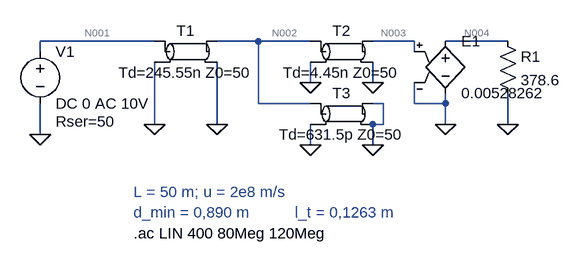
[diagram p0: schematic Q1.asc]
Q1.asc, the LTspice schematic file:
Version 4
SHEET 1 880 700
WIRE 96 128 -80 128
WIRE 256 128 192 128
WIRE 336 128 256 128
WIRE 496 128 432 128
WIRE 640 128 544 128
WIRE -80 144 -80 128
WIRE 496 144 496 128
WIRE 336 192 336 160
WIRE 432 192 432 160
WIRE 256 224 256 128
WIRE 336 224 256 224
WIRE 448 224 432 224
WIRE 496 224 496 192
WIRE 544 224 544 208
WIRE 544 224 496 224
WIRE 96 256 96 160
WIRE 192 256 192 160
WIRE 448 256 448 224
WIRE 448 256 432 256
WIRE 544 256 544 224
WIRE 640 256 640 208
WIRE -80 272 -80 224
WIRE 336 288 336 256
WIRE 432 288 432 256
FLAG -80 272 0
FLAG 96 256 0
FLAG 192 256 0
FLAG 640 256 0
FLAG 336 288 0
FLAG 432 288 0
FLAG 432 192 0
FLAG 336 192 0
FLAG 544 256 0
SYMBOL tline 144 144 R0
SYMATTR InstName T1
SYMATTR Value Td=245.55n Z0=50
SYMBOL res 624 112 R0
SYMATTR InstName R1
SYMATTR Value 378.6
SYMBOL voltage -80 128 R0
WINDOW 123 0 0 Left 0
WINDOW 39 24 124 Left 2
SYMATTR SpiceLine Rser=50
SYMATTR InstName V1
SYMATTR Value DC 0 AC 10V
SYMBOL tline 384 144 R0
SYMATTR InstName T2
SYMATTR Value Td=4.45n Z0=50
SYMBOL tline 384 240 R0
SYMATTR InstName T3
SYMATTR Value Td=631.5p Z0=50
SYMBOL e 544 112 R0
SYMATTR InstName E1
SYMATTR Value 0.00528262
TEXT 64 424 Left 2 !.ac LIN 400 80Meg 120Meg
TEXT 64 392 Left 2 ;d_min = 0,890 m
TEXT 312 392 Left 2 ;l_t = 0,1263 m
TEXT 64 360 Left 2 ;L = 50 m; u = 2e8 m/s

The netlist it stands for:
* Q1.asc
T1 N001 0 N002 0 Td=245.55n Z0=50
R1 N004 0 378.6
V1 N001 0 DC 0 AC 10V Rser=50
T2 N002 0 N003 0 Td=4.45n Z0=50
T3 N002 0 0 0 Td=631.5p Z0=50
E1 N004 0 N003 0 0.00528262
.ac LIN 400 80Meg 120Meg
* d_min = 0,890 m
* l_t = 0,1263 m
* L = 50 m; u = 2e8 m/s
.backanno
.end

* Results of the author's LTspice run, read from the files saved beside the schematic
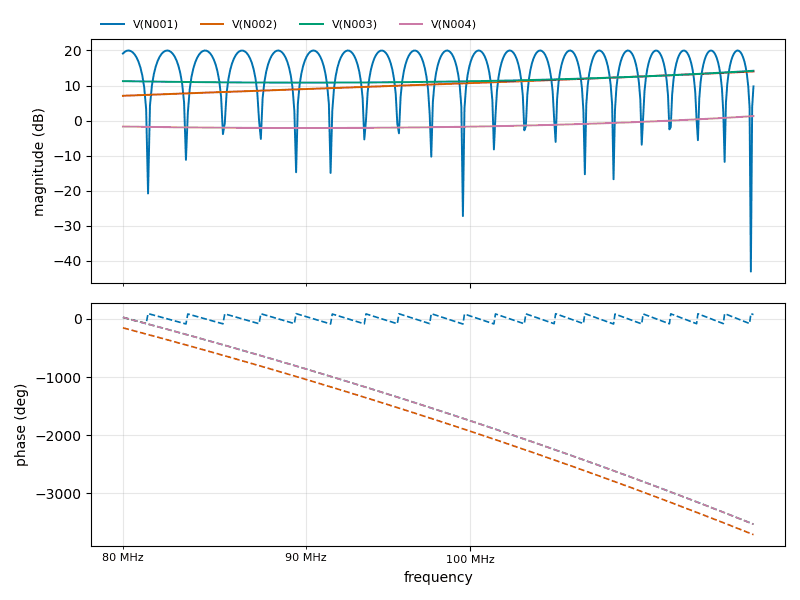
[diagram p1: AC Analysis of Q1.asc, plotted from the saved traces]
* AC Analysis, 1 run:
*   V(N001): 19.14 dB at 80 MHz, 9.75 dB at 120 MHz, peak 20.00 dB at 90.43 MHz, 3 dB below the peak at 89.92 MHz and 90.93 MHz
*   V(N002): 7.07 dB at 80 MHz, 14.02 dB at 120 MHz, peak 14.02 dB at 120 MHz, 3 dB below the peak at 102 MHz
*   V(N003): 11.25 dB at 80 MHz, 14.22 dB at 120 MHz, peak 14.22 dB at 120 MHz, 3 dB below the peak at 99.91 MHz
*   V(N004): -1.70 dB at 80 MHz, 1.26 dB at 120 MHz, peak 1.26 dB at 120 MHz, 3 dB below the peak at 99.91 MHz